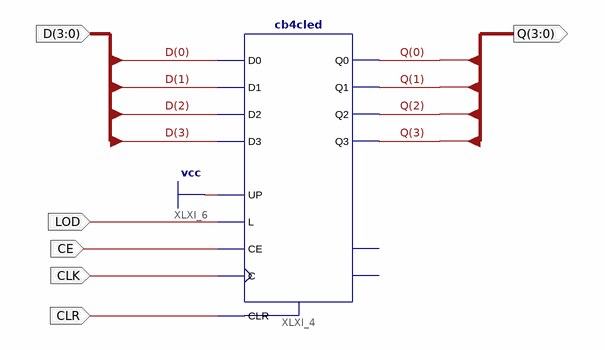
[diagram p0: schematic sheet 1]
// Xilinx ISE schematic pc.sch (spartan6) as structural Verilog: 1 symbols, 6 ports
module pc (
  input  CLK,
  input  CE,
  input  CLR,
  input  LOD,
  input  [3:0] D,
  output [3:0] Q
);

  cb4cled XLXI_4 (
    .C(CLK), .CE(CE), .CLR(CLR), .D0(D[0]), .D1(D[1]), .D2(D[2]), .D3(D[3]), .L(LOD), .UP(1'b1), .Q0(Q[0]),
    .Q1(Q[1]), .Q2(Q[2]), .Q3(Q[3]));  // open: CEO, TC
endmodule
